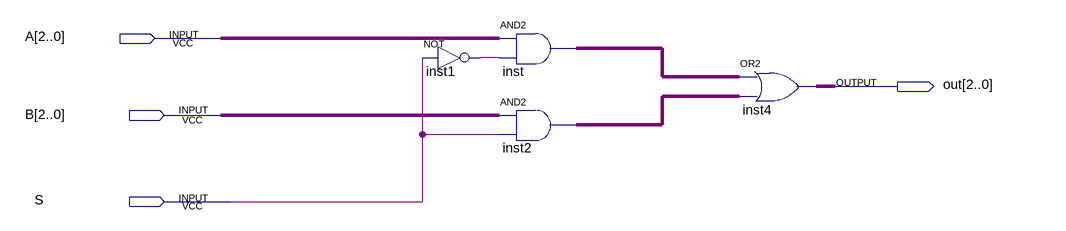
[diagram p0: schematic sheet]
// Quartus schematic MUX213BIT.bdf as structural Verilog: 4 symbols, 4 pins
module MUX213BIT (
  input  [2:0] A,
  input  [2:0] B,
  input  S,
  output [2:0] out
);

  wire inst1_out;
  wire [2:0] inst2_out, inst_out;

  not inst1 (inst1_out, S);
  assign inst_out = A & {3{inst1_out}};  // AND2 inst, 3 bits wide
  assign inst2_out = B & {3{S}};  // AND2 inst2, 3 bits wide
  assign out = inst_out | inst2_out;  // OR2 inst4, 3 bits wide
endmodule
